# EAGLE design Saab_ACC 5045158_1 (EAGLE 7.6.0)
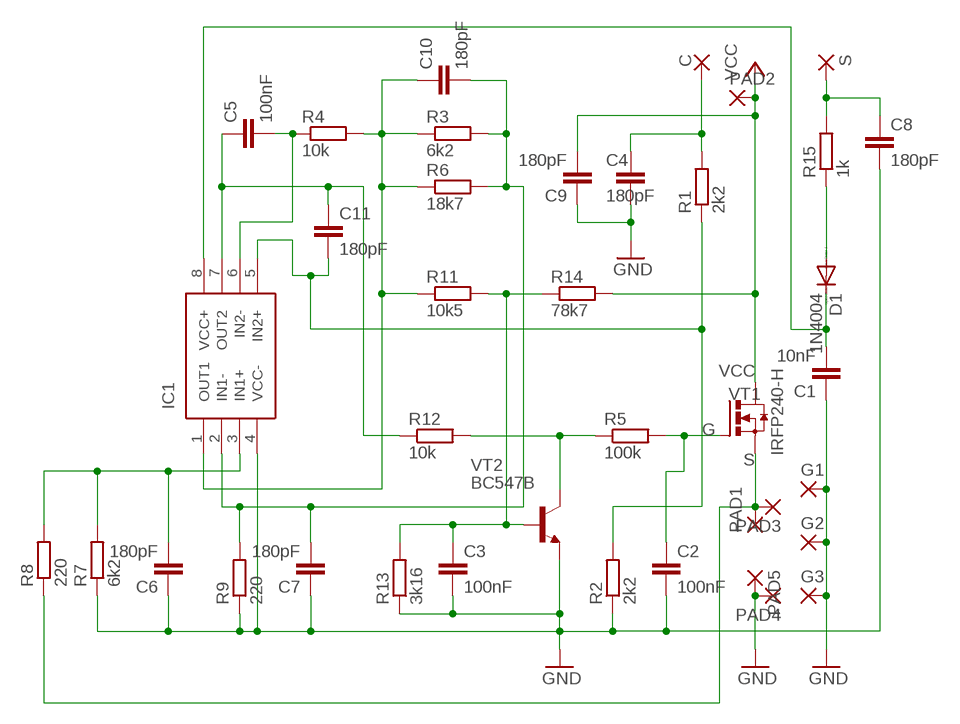
[diagram p0: schematic, sheet 1]

## Parts
C  3,17/1,3  [3,17/1,3]
C1  10nF  C2.5/2  [C2.5-2]
C2  100nF  C-EU050-024X044  [C050-024X044]
C3  100nF  C-EU050-024X044  [C050-024X044]
C4  180pF  C-EUC0805K  [C0805K]
C5  100nF  C-EU050-024X044  [C050-024X044]
C6  180pF  C-EUC0805K  [C0805K]
C7  180pF  C-EUC0805K  [C0805K]
C8  180pF  C-EUC0805K  [C0805K]
C9  180pF  C-EUC0805K  [C0805K]
C10  180pF  C-EUC0805K  [C0805K]
C11  180pF  C-EUC0805K  [C0805K]
D1  1N4004  [DO41-10]
G1  3,81/1,4  [3,81/1,4]
G2  3,17/1,3  [3,17/1,3]
G3  3,17/1,3  [3,17/1,3]
IC1  LM2904YDT  [SOIC127P600X175-8N]
PAD1  SMD5  [SMD2,54-5,08]
PAD2  3,81/1,4  [3,81/1,4]
PAD3  SMD5  [SMD2,54-5,08]
PAD4  SMD5  [SMD2,54-5,08]
PAD5  SMD5  [SMD2,54-5,08]
R1  2k2  R-EU_0204/5  [0204/5]
R2  2k2  R-EU_0204/5  [0204/5]
R3  6k2  R-EU_0204/5  [0204/5]
R4  10k  R-EU_0204/5  [0204/5]
R5  100k  R-EU_0204/5  [0204/5]
R6  18k7  R-EU_0207/10  [0207/10]
R7  6k2  R-EU_0204/5  [0204/5]
R8  220  R-EU_0204/5  [0204/5]
R9  220  R-EU_0204/5  [0204/5]
R11  10k5  R-EU_0204/7  [0204/7]
R12  10k  R-EU_0204/5  [0204/5]
R13  3k16  R-EU_0204/7  [0204/7]
R14  78k7  R-EU_0204/7  [0204/7]
R15  1k  R-EU_0204/5  [0204/5]
S  3,17/1,3  [3,17/1,3]
VT1  IRFP240-H  [TO247BH]
VT2  BC547B  [TO92]

## Nets
C: C4.1 C.1(P) R1.2
G: C2.1 R5.2 VT1.G
GND: C1.1 C2.2 C3.2 C4.2 C6.1 C7.1 C8.2 C9.1 G1.1(P) G2.1(P) G3.1(P) IC1.4(VCC-) PAD4.1(P) PAD5.1(P) R2.1 R7.1 R9.1 R13.1 VT2.1(E)
N$1: R5.1 R12.2 VT2.3(C)
N$2: C5.1 C11.1 IC1.7(OUT2) R12.1
N$3: C5.2 IC1.6(IN2-) R4.1
N$4: C10.1 IC1.1(OUT1) R3.1 R4.2 R6.1 R11.1
N$5: C7.2 C10.2 IC1.2(IN1-) R3.2 R6.2 R9.2
N$6: C3.1 R11.2 R13.2 R14.1 VT2.2(B)
N$7: C11.2 IC1.5(IN2+) R1.1 R2.2
N$8: C6.2 IC1.3(IN1+) R7.2 R8.2
N$9: C8.1 R15.2 S.1(P)
N$10: D1.A R15.1
N$11: C1.2 D1.C IC1.8(VCC+)
S: PAD1.1(P) PAD3.1(P) R8.1 VT1.S
VCC: C9.2 PAD2.1(P) R14.2 VT1.D

## Library data of the parts
C G2 G3 S = wirepad:3,17/1,3: THROUGH-HOLE PAD
C1 = capacitor-wima:C: CAPACITOR naming: grid - package width
C2-C11 = rcl:C-EU: CAPACITOR, European symbol
D1 = diode:1N4004: DIODE general purpose rectifier, 1 A
G1 PAD2 = wirepad:3,81/1,4: THROUGH-HOLE PAD
IC1 = LM2904YDT:LM2904YDT: STMICROELECTRONICS - LM2904YDT - Operational Amplifier, 2 Amplifier, 1.1 MHz, 0.6 V/s, 3V to 30V, SOIC, 8 Pins Source: Datasheet <http://www.st.com/content/ccc/resource/technical/document/datasheet/c8/d5/4d/58/88/9d/44/9f/CD00000535.pdf/files/CD00000535.pdf/jcr:content/translations/en.CD00000535.pdf>; DESCRIPTION: STMICROELECTRONICS - LM2904YDT - Operational Amplifier, 2 Amplifier, 1.1 MHz, 0.6 V/s, 3V to 30V, SOIC, 8 Pins; HEIGHT: 1.75mm; MANUFACTURER_NAME: STMicroelectronics; MANUFACTURER_PART_NUMBER: LM2904YDT; MOUSER_PART_NUMBER: 511-LM2904YDT; MOUSER_PRICE-STOCK: https://www.mouser.co.uk/ProductDetail/STMicroelectronics/LM2904YDT?qs=5J552fbOmooHIfOIrnuKOA%3D%3D
PAD1 PAD3-PAD5 = wirepad:SMD5: SMD PAD
R1-R5 R7-R9 R11 R13 R14 = rcl:R-EU_: RESISTOR, European symbol
R6 R12 R15 = resistor:R-EU_: RESISTOR, European symbol
VT1 = transistor-power:IRFP240: HEXFET Power MosFet Source: http://www.irf.com/
VT2 = transistor-npn:BC547*: NPN Transistor

## Board
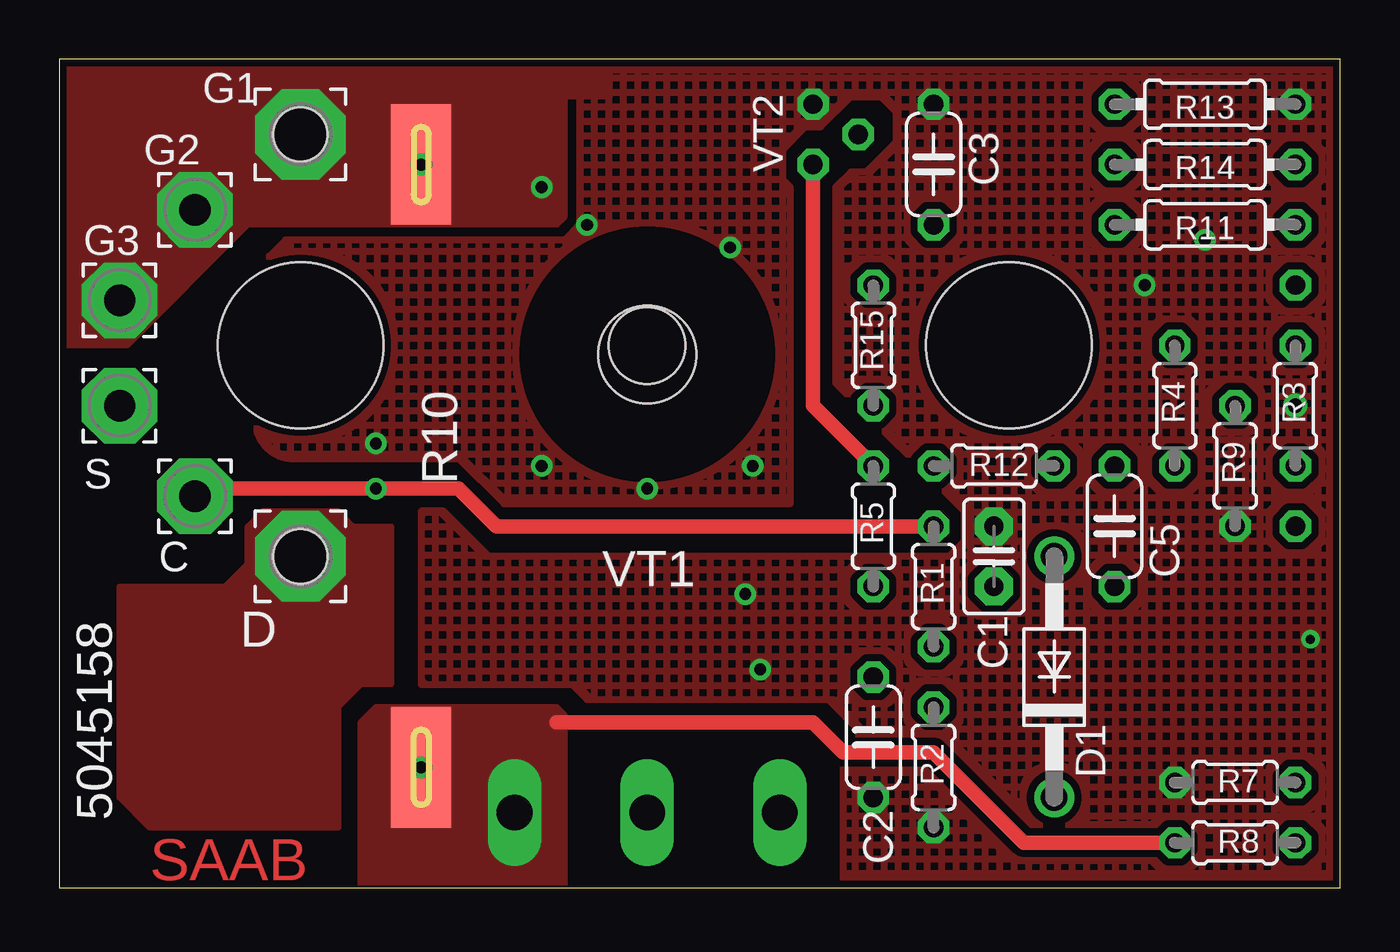
[diagram p1: board, top side]
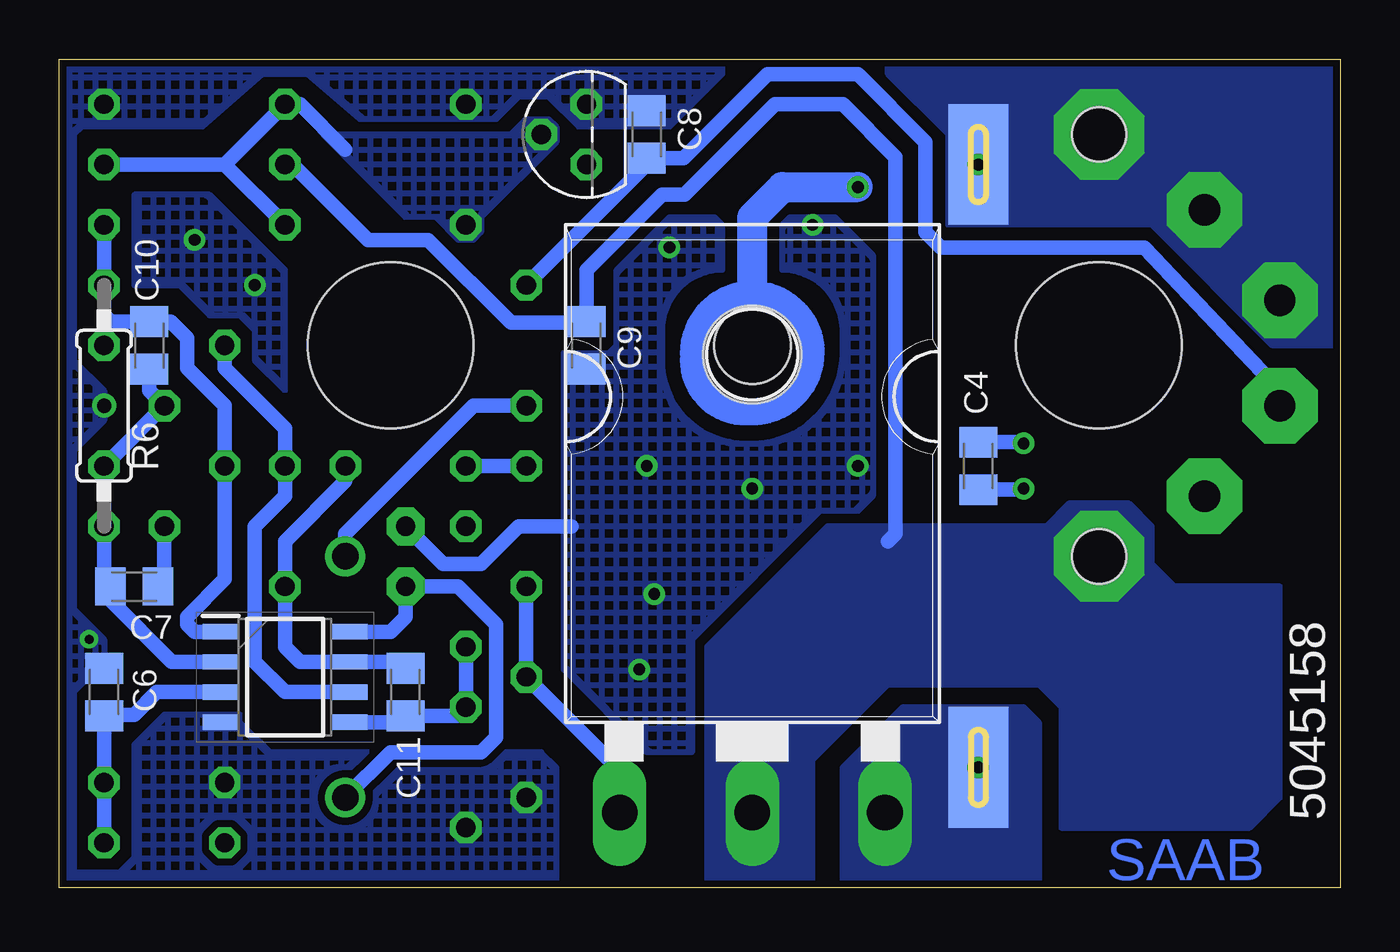
[diagram p2: board, bottom side, seen from below]

Size 53.95 x 34.91 mm. Coordinates in mm from the lower left corner, seen from the top.
Outline: 0,0 53.95,0 53.95,34.91 0,34.91 0,0
Copper layers (1*16): Top 0.035mm / dielectric 1.5mm / Bottom 0.035mm
Design rules "default *": minimum track width 10mil, minimum drill 24mil, track to track 8mil, track to pad 8mil, pad to pad 8mil, via to via 8mil, smd to smd 8mil, copper to edge 4mil, drill to drill 8mil, minimum pad ring 10mil, minimum via ring 8mil, stop-mask expansion 4mil, vias tented up to drill 25mil, thermal gap 10mil
Holes 6.99 mm at 10.16,22.86 40.01,22.86
Holes 3.23 mm at 24.77,22.86
Holes 2.29 mm at 10.16,13.97 10.16,31.75
Milling: area 14.9,28.9 to 15.6,32.1; area 14.9,3.5 to 15.6,6.7

### Footprints (pad centres in the part's own frame; a part is rotated, then mirrored left to right if it is on the bottom)
3,17/1,3 = drill 1.321 pad 3.175 octagon: 1 0,0
C2.5-2 = drill 0.813 pad 1.6 octagon: 1 -1.27,0; 2 1.27,0
C050-024X044 = drill 0.813 octagon: 1 -2.54,0; 2 2.54,0
C0805K = smd 1.3 x 1.6: 1 -1,0; 2 1,0
DO41-10 = drill 1.118: A 5.08,0; C -5.08,0
3,81/1,4 = drill 1.397 pad 3.81 octagon: 1 0,0
SOIC127P600X175-8N = smd 1.525 x 0.65: 1 -2.712,1.905; 2 -2.712,0.635; 3 -2.712,-0.635; 4 -2.712,-1.905; 5 2.712,-1.905; 6 2.712,-0.635; 7 2.712,0.635; 8 2.712,1.905
SMD2,54-5,08 = smd 2.54 x 5.08: 1 0,0
0204/5 = drill 0.813 octagon: 1 -2.54,0; 2 2.54,0
0207/10 = drill 0.813 octagon: 1 -5.08,0; 2 5.08,0
0204/7 = drill 0.813 octagon: 1 -3.81,0; 2 3.81,0
TO247BH = drill 1.499 long: D 0,-10.16; G -5.588,-10.16; S 5.588,-10.16 | hole 4.115: 0,9.144
TO92 = drill 0.813 octagon: 1 1.27,0; 2 0,1.905; 3 -1.27,0

### Placement (x,y rotation side)
C  5.71,16.51 0 top
C1  39.37,13.97 270 top
C2  34.29,6.35 270 top
C3  36.83,30.48 90 top
C4  15.24,17.78 90 bottom
C5  44.45,15.24 90 top
C6  52.07,8.26 270 bottom
C7  50.8,12.7 180 bottom
C8  29.21,31.75 90 bottom
C9  31.75,22.86 90 bottom
C10  50.16,22.86 270 bottom
C11  39.37,8.26 270 bottom
D1  41.91,8.89 90 top
G1  10.16,31.75 0 top
G2  5.71,28.57 0 top
G3  2.54,24.77 0 top
IC1  44.45,8.89 0 bottom
PAD1  15.24,5.08 0 top
PAD2  10.16,13.97 0 top
PAD3  15.24,5.08 0 bottom
PAD4  15.24,30.48 0 bottom
PAD5  15.24,30.48 0 top
R1  36.83,12.7 90 top
R2  36.83,5.08 90 top
R3  52.07,20.32 270 top
R4  46.99,20.32 270 top
R5  34.29,15.24 270 top
R6  52.07,20.32 270 bottom
R7  49.53,4.45 0 top
R8  49.53,1.91 0 top
R9  49.53,17.78 90 top
R11  48.26,27.94 180 top
R12  39.37,17.78 180 top
R13  48.26,33.02 180 top
R14  48.26,30.48 180 top
R15  34.29,22.86 90 top
S  2.54,20.32 0 top
VT1  24.77,13.34 0 bottom
VT2  31.75,31.75 90 bottom

### Tracks (layer width: path | path; a pad name or v marks a point on that pad's centre or on a via)
C  (via drill 0.5)
  Top 0.61: R1.2 18.41,15.24 16.83,16.83 v13.34,16.83 6.03,16.83 C.1
  Bottom 0.61: C4.1 13.38,16.78 v13.34,16.83
G
  Bottom 0.61: VT1.G 30.35,4.95 C2.1 R5.2
GND  (via drill 0.38, 0.5, 0.6)
  Bottom 0.61: R9.1 49.53,12.97 C7.1 | C4.2 13.38,18.78 v13.34,18.73 | C1.1 37.78,13.65 36.2,13.65 34.61,15.24 32.38,15.24
  Bottom 1.016: 27.3,22.54 arc90 24.77,25.08 arc90 22.23,22.54 arc90 24.77,20 25.08,20 arc90 27.3,22.23
  Bottom 1.27: 24.77,25.08 24.77,28.26 23.5,29.53 v20.32,29.53
  other vias: 15.24,30.48 52.07,20.32 20.32,17.78 24.77,16.83 29.21,17.78 28.26,26.99 22.23,27.94 45.72,25.4 48.26,27.3 28.89,12.38 29.53,9.21 52.7,10.48
  pour Bottom (isolate 0.305, no thermals): 0,22.86 2.86,22.86 7.94,27.94 16.51,27.94 16.51,31.75 19.05,34.29 19.05,35.56 0,35.56
  pour Bottom (isolate 0.305, no thermals, hatched): 26.04,34.92 26.04,34.29 28.26,32.07 32.07,32.07 33.34,33.34 34.61,33.34 35.56,32.38 41.27,32.38 43.5,34.29 45.4,34.29 47.94,32.07 53.02,32.07 53.34,31.75 53.34,22.23 52.07,20.95 52.07,19.68 53.34,18.41 53.34,11.75 52.07,10.48 52.07,9.53 53.34,8.26 53.34,0 53.98,0 53.98,34.92
  pour Bottom (isolate 0.305, no thermals, hatched): 33.02,0 33.02,5.08 33.66,5.71 45.09,5.71 46.35,6.99 46.35,7.3 49.53,7.3 50.8,6.03 50.8,1.27 51.44,0.64 53.98,0.64 53.98,0
  pour Top (isolate 0.305, no thermals, hatched): 8.26,19.68 arc90 9.84,18.1 16.83,18.1 18.73,16.19 30.8,16.19 30.8,29.53 30.48,29.84 30.48,31.11 31.43,32.07 32.07,32.07 33.34,33.34 34.61,33.34 35.24,32.7 35.24,31.43 33.97,30.16 33.34,30.16 32.7,29.53 32.7,21.27 38.1,15.88 38.1,14.61 37.47,13.97 18.1,13.97 16.19,15.88 15.24,15.88 15.24,8.57 21.59,8.57 22.23,7.94 32.38,7.94 33.66,6.67 33.66,5.71 33.02,5.08 33.02,0 53.98,0 53.98,35.24 21.91,35.24 21.91,27.94 21.27,27.3 9.53,27.3 8.26,26.04
  pour Top (isolate 0.305, no thermals): 0,35.24 22.86,35.24 23.18,34.92 23.18,33.34 21.27,33.34 21.27,28.26 20.95,27.94 7.94,27.94 2.86,22.86 0,22.86
  pour Bottom (isolate 0.305, no thermals, hatched): 23.5,26.04 23.5,27.94 23.18,28.26 21.27,28.26 19.68,26.67 19.68,16.51 20.32,15.88 21.91,15.88 27.3,10.48 27.3,5.71 29.21,5.71 32.7,9.21 32.7,22.54 30.8,22.54 30.48,22.86 30.48,26.04 28.26,28.26 26.35,28.26 26.04,27.94 26.04,26.04 arc-90 28.57,23.5 28.57,22.23 arc-90 25.08,18.73 24.77,18.73 arc-90 20.95,22.54 20.95,23.5 arc-90
  pour Bottom (isolate 0.305, no thermals, hatched): 44.45,20.95 44.45,26.04 47.62,29.21 50.8,29.21 50.8,25.4 48.9,25.4 47.62,24.13 46.35,24.13 45.72,23.5 45.72,22.23
N$1
  Top 0.61: VT2.3 31.75,20.32 R5.1
  Bottom 0.61: R5.1 R12.2
N$2
  Bottom 0.61: R12.1 41.91,17.14 44.45,14.61 C5.1 44.45,10.16 43.81,9.53 IC1.7 39.64,9.53 C11.1
N$3
  Bottom 0.61: R4.1 46.99,21.91 44.45,19.37 C5.2 44.45,16.51 45.72,15.24 45.72,9.53 44.45,8.26 IC1.6
N$4
  Bottom 0.61: R11.1 R6.1 52.07,24.13 | 52.07,24.13 52.07,23.5 | 52.07,23.5 R3.1 | 51.7,23.86 52.07,23.5 | 52.07,24.13 51.8,23.86 C10.1 49.26,23.86 48.58,23.18 48.58,21.91 46.99,20.32 R4.2 46.99,13.02 48.58,11.43 48.58,11.11 48.26,10.79 IC1.1
N$5
  Bottom 0.61: C10.2 50.16,20.95 R9.2 R3.2 R6.2 52.07,12.97 C7.2 51.8,12.11 49.21,9.53 IC1.2
N$6
  Bottom 0.61: R14.1 46.99,30.48 | 46.99,30.48 R13.2 43.81,33.02 41.91,31.11 | R11.2 46.99,30.48
  pour Bottom (isolate 0.305, no thermals, hatched): 42.86,31.75 34.92,31.75 34.29,32.38 33.34,32.38 33.02,32.07 33.02,31.43 36.2,28.26 36.2,27.62 36.51,27.3 37.15,27.3 38.1,28.26 39.37,28.26
N$7
  Bottom 0.61: R1.1 R2.2 37.2,7.25 C11.2 39.64,6.99 IC1.5
N$8
  Bottom 0.61: R8.2 R7.2 C6.2 52.02,7.3 50.8,7.3 49.85,8.26 IC1.3
N$9
  Bottom 0.61: S.1 2.54,20.95 8.26,26.99 16.83,26.99 17.46,27.62 17.46,31.43 20.32,34.29 24.13,34.29 27.67,30.75 C8.1 29.21,30.48 R15.2
N$10
  Bottom 0.61: R15.1 36.51,20.32 41.91,14.92 D1.A
N$11
  Bottom 0.61: D1.C 40.01,5.71 36.2,5.71 35.56,6.35 35.56,11.11 37.15,12.7 C1.2 39.37,11.43 40.01,10.79 IC1.8
S  (via drill 0.5)
  Top 0.61: R8.1 40.64,1.91 36.83,5.71 33.02,5.71 31.75,6.99 20.95,6.99
  other vias: 15.24,5.08
  pour Bottom (isolate 0.305, no thermals): 20.95,0 20.95,5.08 18.41,7.62 13.34,7.62 12.7,6.99 12.7,0
  pour Top (no thermals): 12.7,0 12.7,6.99 13.34,7.62 20.95,7.62 21.27,7.3 21.27,0
VCC
  Bottom 0.61: 19.05,14.61 18.73,14.92 18.73,30.8 20.95,33.02 23.81,33.02 27.62,29.21 28.57,29.21 31.75,26.04 C9.2 31.8,23.81 34.92,23.81 38.42,27.3 40.96,27.3 44.13,30.48 R14.2
  pour Bottom (isolate 0.305, no thermals): 22.23,0 22.23,5.4 19.05,8.57 12.7,8.57 11.75,7.62 11.75,2.54 3.81,2.54 2.54,3.81 2.54,12.7 6.99,12.7 7.94,13.65 7.94,15.24 8.89,16.19 11.43,16.19 12.38,15.24 21.59,15.24 26.67,10.16 26.67,0
  pour Top (no thermals): 2.54,12.7 6.99,12.7 7.94,13.65 7.94,15.24 8.57,15.88 11.75,15.88 12.38,15.24 13.97,15.24 13.97,8.57 12.7,8.57 11.75,7.62 11.75,2.54 3.81,2.54 2.54,3.81

### Text on the board
Top: SAAB
Bottom: SAAB
tNames: R10 | D | 5045158
bNames: 5045158